# Altium project Mouse-Wheel-Project.PrjPCB
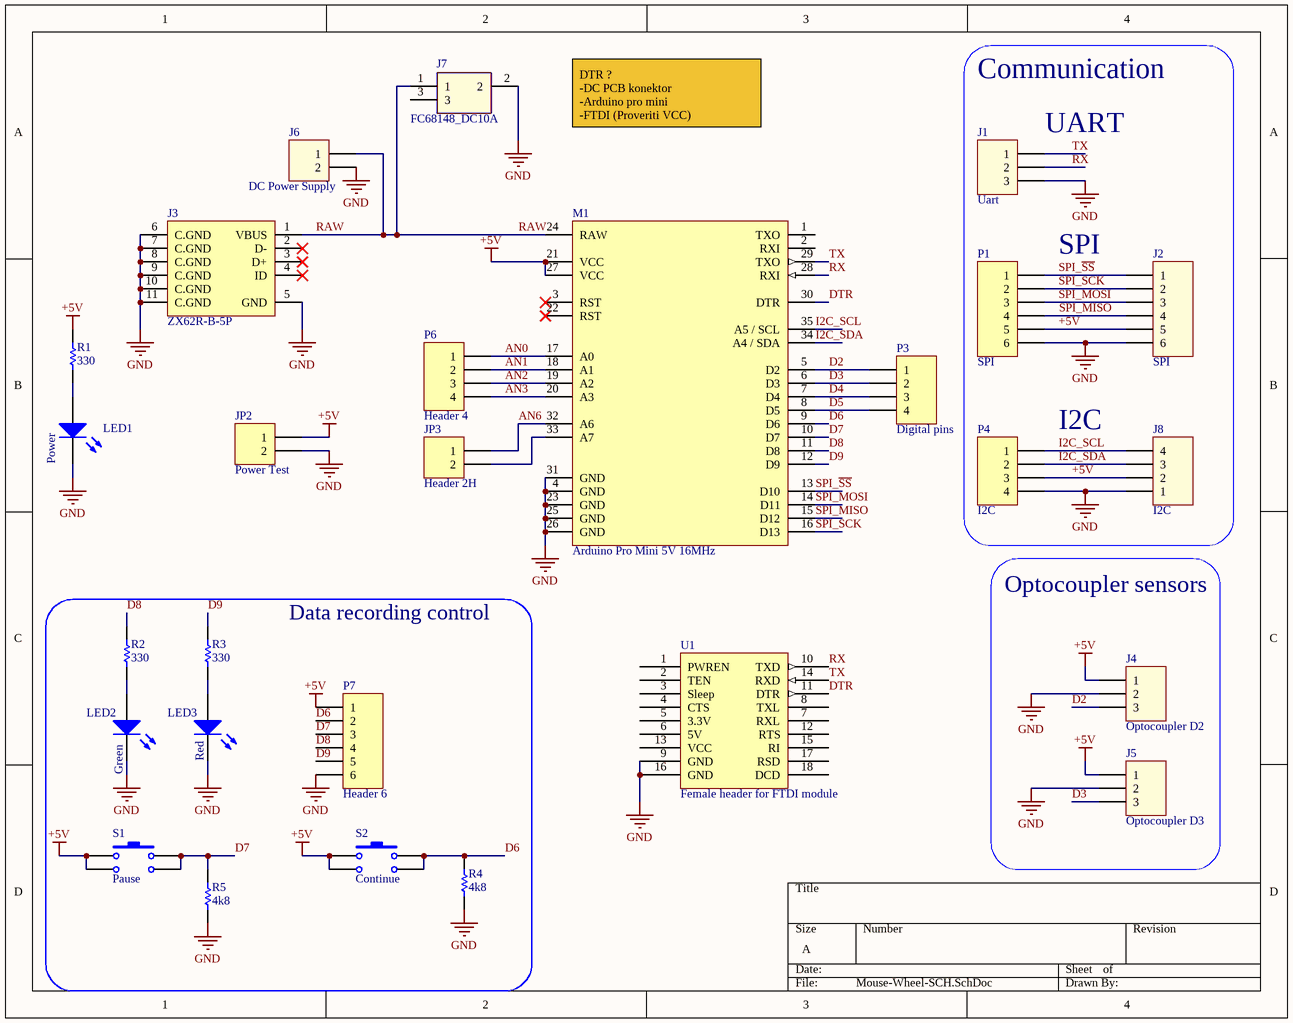
[diagram p0: Mouse-Wheel-SCH.SchDoc]
1 sheet, 27 parts. Net scope: global (net labels, ports and power ports of the same name join across sheets).
Board file: Mouse-Wheel-PCB.PcbDoc

## Sheet Mouse-Wheel-SCH.SchDoc
size A

### Parts
J1  Uart  [61900311121]
J2  SPI  [61900611021]
J3  ZX62R-B-5P  [Micro USB b]
J4  Optocoupler D2  [61900311121]
J5  Optocoupler D3  [61900311121]
J6  DC Power Supply  [61900211021]
J7  FC68148_DC10A  [FC68148DC10A]
J8  I2C  [61900411021]
JP2  Power Test  [HDR1X2]
JP3  Header 2H  [HDR1X2]
LED1  Power  [LED]
LED2  Green  [LED RADIAL 5MM GREEN]
LED3  Red  [LED RADIAL 5MM RED]
M1  Arduino Pro Mini 5V 16MHz  [Arduino Pro Mini]
P1  SPI  [HDR1X6]
P3  Digital pins  [HDR1X4]
P4  I2C  [HDR1X4]
P6  Header 4  [HDR1X4]
P7  Header 6  [HDR1X6]
R1  330  [AXIAL-3mm]
R2  330  [AXIAL-3mm]
R3  330  [AXIAL-3mm]
R4  4k8  [AXIAL-3mm]
R5  4k8  [AXIAL-3mm]
S1  Pause  [SW-TACT]
S2  Continue  [SW-TACT]
U1  Female header for FTDI module  [FTDI_Module]

### Blocks framed on the sheet
Data recording control: LED2 LED3 P7 R2-R5 S1 S2
Optocoupler sensors: J4 J5

### Nets
+5V: J2.5 J4.1 J5.1 J8.2 JP2.1 M1.21(VCC) M1.27(VCC) P1.5 P4.3 P7.1 R1.1 S1.1 S1.2 S2.1 S2.2
GND: J1.3 J2.6 J3.5(GND) J3.6(C.GND) J3.7(C.GND) J3.8(C.GND) J3.9(C.GND) J3.10(C.GND) J3.11(C.GND) J4.2 J5.2 J6.2 J7.2 J8.1 JP2.2 LED1.2(K) LED2.2(K) LED3.2(K) M1.4(GND) M1.23(GND) M1.25(GND) M1.26(GND) M1.31(GND) P1.6 P4.4 P7.6 R4.1 R5.1 U1.9(GND) U1.16(GND)
AN0: M1.17(A0) P6.1
AN1: M1.18(A1) P6.2
AN2: M1.19(A2) P6.3
AN3: M1.20(A3) P6.4
AN6: JP3.1 M1.32(A6)
D2: J4.3 M1.5(D2) P3.1
D3: J5.3 M1.6(D3) P3.2
D4: M1.7(D4) P3.3
D5: M1.8(D5) P3.4
D6: M1.9(D6) P7.2 R4.2 S2.3 S2.4
D7: M1.10(D7) P7.3 R5.2 S1.3 S1.4
D8: M1.11(D8) P7.4 R2.1
D9: M1.12(D9) P7.5 R3.1
DTR: M1.30(DTR) U1.11(DTR)
I2C_SCL: J8.4 M1.35(A5_/_SCL) P4.1
I2C_SDA: J8.3 M1.34(A4_/_SDA) P4.2
RAW: J3.1(VBUS) J6.1 J7.1 M1.24(RAW)
RX: J1.2 M1.28(RXI) U1.10(TXD)
SPI_MISO: J2.4 M1.15(D12) P1.4
SPI_MOSI: J2.3 M1.14(D11) P1.3
SPI_~{SS}: J2.1 M1.13(D10) P1.1
SPI_SCK: J2.2 M1.16(D13) P1.2
TX: J1.1 M1.29(TXO) U1.14(RXD)
NetJP3_2: JP3.2 M1.33(A7)
NetLED1_1: LED1.1(A) R1.2
NetLED2_1: LED2.1(A) R2.2
NetLED3_1: LED3.1(A) R3.2

Not connected (* = marked no-connect by the designer): J3 2(D-)* 3(D+)* 4(ID)*; J7 3; M1 1(TXO) 2(RXI) 3(RST)* 22(RST)*; U1 1(PWREN) 2(TEN) 3(Sleep) 4(CTS) 5(3.3V) 6(5V) 7(RXL) 8(TXL) 12(RTS) 13(VCC) 15(RI) 17(RSD) 18(DCD)

### Notes on the sheet
- Communication
- DTR ?
  -DC PCB konektor
  -Arduino pro mini
  -FTDI (Proveriti VCC)
- (near J1) UART
- SPI
- I2C

### Library data of the parts
J1 J4 J5 = 61900311121: WR-WTB 2.54mm Male Locking Header, 3p; Pin Number: 3; ComponentLink1Description: Manufacturer; ComponentLink1URL: http://www.we-online.de; ComponentLink2Description: Datasheet; ComponentLink2URL: http://katalog.we-online.de/em/datasheet/6190xx11121.pdf; Part Number: 61900311121; Published Date: June 2017; Publisher: Wurth Elektronik; Pitch: 2.54 mm
J2 = 61900611021: WR-WTB 2.54mm Male Left Angled Header Bottom Locking, 6p; Pin Number: 6; ComponentLink1Description: Manufacturer; ComponentLink1URL: http://www.we-online.de; ComponentLink2Description: Datasheet; ComponentLink2URL: http://katalog.we-online.de/em/datasheet/6190xx11021.pdf; Part Number: 61900611021; Published Date: June 2017; Publisher: Wurth Elektronik; Pitch: 2.54 mm
J3 = ZX62R-B-5P: SMD Micro USB Connector; Supplier 1: Digi-Key; Supplier Part Number 1: H11574TR-ND
J6 = 61900211021: WR-WTB 2.54mm Male Left Angled Header Bottom Locking, 2p; Pin Number: 2; ComponentLink1Description: Manufacturer; ComponentLink1URL: http://www.we-online.de; ComponentLink2Description: Datasheet; ComponentLink2URL: http://katalog.we-online.de/em/datasheet/6190xx11021.pdf; Part Number: 61900211021; Published Date: June 2017; Publisher: Wurth Elektronik; Pitch: 2.54 mm
J7 = FC68148_DC10A: CLIFF ELECTRONIC COMPONENTS - FC68148 DC10A - SOCKET, PCB, DC POWER, 2.1MM, PK10; Geometry.Height: 11mm; Manufacturer_Name: CLIFF ELECTRONIC COMPONENTS; Manufacturer_Part_Number: FC68148 DC10A; RS Part Number: *; RS Price/Stock: *; Arrow Part Number: FC68148 DC10A; Arrow Price/Stock: *; Datasheet Link: http://www.cliffuk.co.uk/products/dcconnectors/FC68148.pdf
J8 = 61900411021: WR-WTB 2.54mm Male Left Angled Header Bottom Locking, 4p; Pin Number: 4; ComponentLink1Description: Manufacturer; ComponentLink1URL: http://www.we-online.de; ComponentLink2Description: Datasheet; ComponentLink2URL: http://katalog.we-online.de/em/datasheet/6190xx11021.pdf; Part Number: 61900411021; Published Date: June 2017; Publisher: Wurth Elektronik; Pitch: 2.54 mm
JP2 JP3 = Header 2H: Header, 2-Pin, Right Angle; LatestRevisionDate: 17-Jul-2002; LatestRevisionNote: Re-released for DXP Platform.; Publisher: Altium Limited
LED1 = LED: Typical RED, GREEN, YELLOW, AMBER GaAs LED; Published: 8-Jun-2000; LatestRevisionDate: 17-Jul-2002; LatestRevisionNote: Re-released for DXP Platform.; PackageVersion: Feb-2002; PackageReference: 3.2X1.6X1.1; Publisher: Altium Limited; PackageDescription: SM LED; 2 Flat Leads
LED2 = LED RADIAL 5MM GREEN: LED RADIAL; Supplier 1: Digi-Key; Supplier Part Number 1: C503B-RCN-CW0Z0AA1-ND
LED3 = LED RADIAL 5MM RED: LED RADIAL; Supplier 1: Digi-Key; Supplier Part Number 1: C503B-RCN-CW0Z0AA1-ND
P1 P7 = Header 6: Header, 6-Pin; LatestRevisionDate: 17-Jul-2002; LatestRevisionNote: Re-released for DXP Platform.; Publisher: Altium Limited
P3 P4 P6 = Header 4: Header, 4-Pin; LatestRevisionDate: 17-Jul-2002; LatestRevisionNote: Re-released for DXP Platform.; Publisher: Altium Limited
R1-R5 = Res1: Resistor; Published: 8-Jun-2000; LatestRevisionDate: 17-Jul-2002; LatestRevisionNote: Re-released for DXP Platform.; PackageReference: AXIAL-0.3; Publisher: Altium Limited; PackageDescription: Axial Device, Thru-Hole; 2 Leads; 0.3 in Pin Spacing
S1 S2 = SW-PB: B3F-1002 SWITCH TACT 6MM MOM 150GF; Published: 24-Mar-1999; LatestRevisionDate: 17-Jul-2002; LatestRevisionNote: Re-released for DXP Platform.; PackageReference: SPST-2; Publisher: Altium Limited
U1 = Module_FTDI: Connection header for custom FTDI module